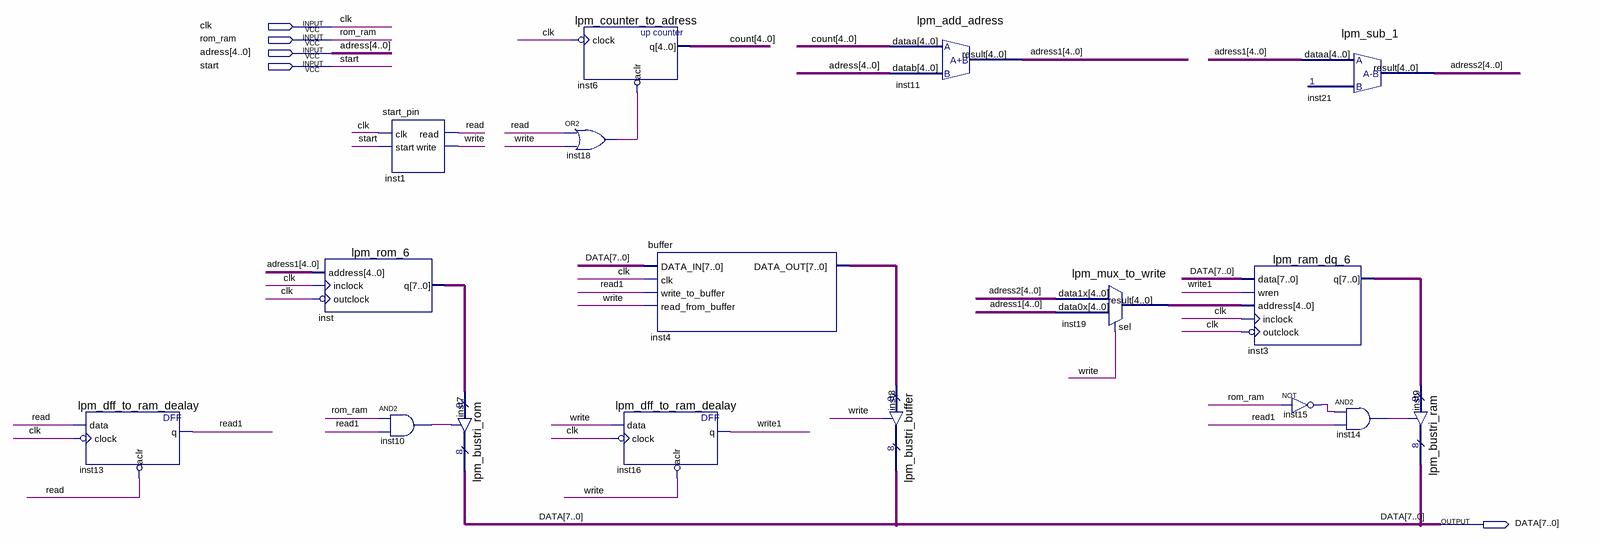
[diagram p0: schematic sheet]
// Quartus schematic result.bdf as structural Verilog: 17 symbols, 5 pins
module result (
  input  clk,
  input  rom_ram,
  input  [4:0] adress,
  input  start,
  output [7:0] DATA
);

  wire inst10_out, inst14_out, inst15_out, inst18_out, read, read1, write, write1;
  wire [4:0] adress1, adress2, count, inst19_result;
  wire [7:0] inst3_q, inst4_data_out, inst_q;

  lpm_dff_to_ram_dealay inst13 (.data(read), .clock(~clk), .aclr(~read), .q(read1));
  lpm_rom_6 inst (.address(adress1), .inclock(clk), .outclock(~clk), .q(inst_q));
  start_pin inst1 (.clk(clk), .start(start), .read(read), .write(write));
  and inst10 (inst10_out, rom_ram, read1);
  lpm_bustri_rom inst7 (.enabledt(inst10_out), .data(inst_q), .tridata(DATA));
  lpm_counter_to_adress inst6 (.clock(~clk), .aclr(~inst18_out), .q(count));
  or inst18 (inst18_out, read, write);
  buffer inst4 (
    .DATA_IN(DATA), .clk(clk), .write_to_buffer(read1), .read_from_buffer(write), .DATA_OUT(inst4_data_out));
  lpm_dff_to_ram_dealay inst16 (.data(write), .clock(~clk), .aclr(~write), .q(write1));
  lpm_add_adress inst11 (.dataa(count), .datab(adress), .result(adress1));
  lpm_bustri_buffer inst8 (.enabledt(write), .data(inst4_data_out), .tridata(DATA));
  lpm_mux_to_write inst19 (.data1x(adress2), .data0x(adress1), .sel(write), .result(inst19_result));
  lpm_ram_dq_6 inst3 (.data(DATA), .wren(write1), .address(inst19_result), .inclock(clk), .outclock(~clk), .q(inst3_q));
  not inst15 (inst15_out, rom_ram);
  lpm_sub_1 inst21 (.dataa(adress1), .result(adress2));
  and inst14 (inst14_out, inst15_out, read1);
  lpm_bustri_ram inst9 (.enabledt(inst14_out), .data(inst3_q), .tridata(DATA));
endmodule
